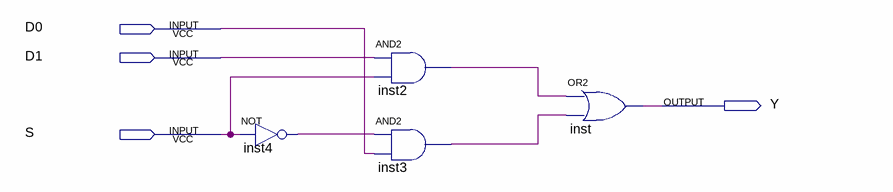
[diagram p0: schematic sheet]
// Quartus schematic MUX2to1.bdf as structural Verilog: 4 symbols, 4 pins
module MUX2to1 (
  input  D0,
  input  D1,
  input  S,
  output Y
);

  wire inst2_out, inst3_out, inst4_out;

  not inst4 (inst4_out, S);
  and inst2 (inst2_out, D1, S);
  and inst3 (inst3_out, inst4_out, D0);
  or inst (Y, inst2_out, inst3_out);
endmodule
